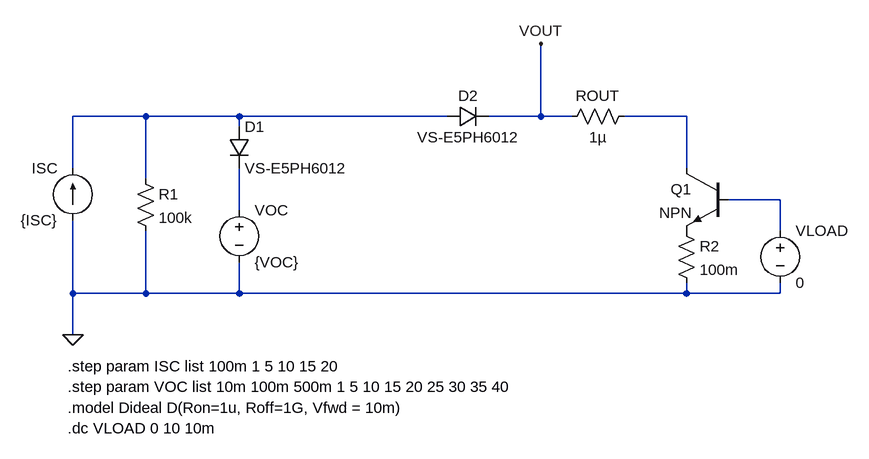
[diagram p0: schematic Ideal_SAS.asc]
Ideal_SAS.asc, the LTspice schematic file:
Version 4.1
SHEET 1 1292 680
WIRE 208 16 96 16
WIRE 352 16 208 16
WIRE 672 16 352 16
WIRE 816 16 816 -96
WIRE 816 16 736 16
WIRE 864 16 816 16
WIRE 1040 16 944 16
WIRE 352 32 352 16
WIRE 96 96 96 16
WIRE 1040 96 1040 16
WIRE 208 112 208 16
WIRE 1184 144 1104 144
WIRE 352 160 352 96
WIRE 1184 192 1184 144
WIRE 96 288 96 176
WIRE 208 288 208 192
WIRE 208 288 96 288
WIRE 352 288 352 240
WIRE 352 288 208 288
WIRE 1040 288 1040 272
WIRE 1040 288 352 288
WIRE 1184 288 1184 272
WIRE 1184 288 1040 288
WIRE 96 352 96 288
FLAG 96 352 0
FLAG 816 -96 VOUT
SYMBOL current 96 176 R180
WINDOW 0 24 80 Left 2
WINDOW 3 24 0 Left 2
SYMATTR InstName ISC
SYMATTR Value {ISC}
SYMBOL res 192 96 R0
SYMATTR InstName R1
SYMATTR Value 100k
SYMBOL diode 336 32 R0
SYMATTR InstName D1
SYMATTR Value VS-E5PH6012
SYMBOL voltage 352 144 R0
SYMATTR InstName VOC
SYMATTR Value {VOC}
SYMBOL res 848 32 R270
WINDOW 0 32 56 VTop 2
WINDOW 3 0 56 VBottom 2
SYMATTR InstName ROUT
SYMATTR Value 1µ
SYMBOL voltage 1184 176 R0
WINDOW 123 0 0 Left 0
WINDOW 39 0 0 Left 0
SYMATTR InstName VLOAD
SYMATTR Value 0
SYMBOL npn 1104 96 M0
SYMATTR InstName Q1
SYMBOL res 1024 176 R0
SYMATTR InstName R2
SYMATTR Value 100m
SYMBOL diode 672 32 R270
WINDOW 0 32 32 VTop 2
WINDOW 3 0 32 VBottom 2
SYMATTR InstName D2
SYMATTR Value VS-E5PH6012
TEXT 88 400 Left 2 !.step param ISC list 100m 1 5 10 15 20
TEXT 88 432 Left 2 !.step param VOC list 10m 100m 500m 1 5 10 15 20 25 30 35 40
TEXT 88 496 Left 2 !.dc VLOAD 0 10 10m
TEXT 88 464 Left 2 !.model Dideal D(Ron=1u, Roff=1G, Vfwd = 10m)

The netlist it stands for:
* Ideal_SAS.asc
ISC 0 N001 {ISC}
R1 N001 0 100k
D1 N001 N004 VS-E5PH6012
VOC N004 0 {VOC}
ROUT VOUT N002 1µ
VLOAD N003 0 0
Q1 N002 N003 P001 0 NPN
R2 P001 0 100m
D2 N001 VOUT VS-E5PH6012
.model D D
.lib standard.dio
.model NPN NPN
.model PNP PNP
.lib standard.bjt
.step param ISC list 100m 1 5 10 15 20
.step param VOC list 10m 100m 500m 1 5 10 15 20 25 30 35 40
.dc VLOAD 0 10 10m
.model Dideal D(Ron=1u, Roff=1G, Vfwd = 10m)
.backanno
.end